# Altium schematic sheet POWER_3.SchDoc
size A; SheetNumber: 5; SheetTotal: 14
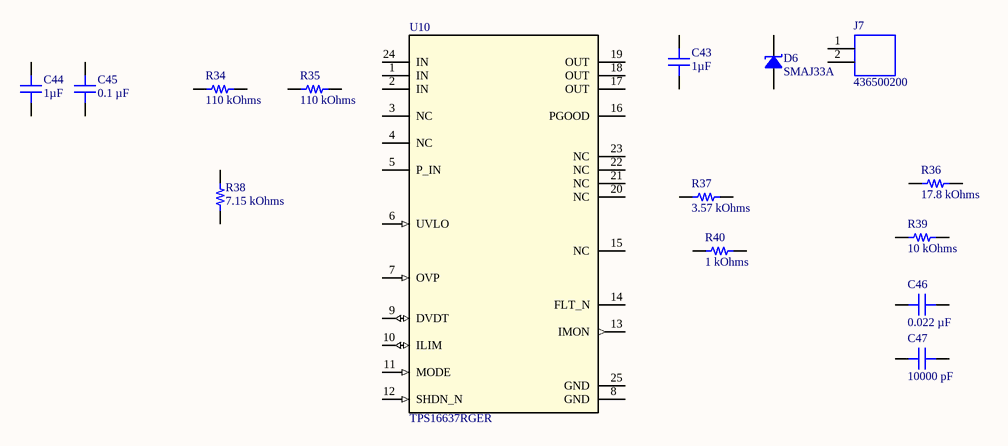
[diagram p0: POWER_3.SchDoc]

## Parts
C43  1µF  [CAP 0805_2012]
C44  1µF  [CAP 0805_2012]
C45  0.1 µF  [CAP 0603_1608]
C46  0.022 µF  [CAP 0603_1608]
C47  10000 pF  [CAP 0603_1608]
D6  SMAJ33A  [DO214AC SMA]
J7  436500200  [CONN_SD-43650-001_02_MOL]
R34  110 kOhms  [RES 0603_1608]
R35  110 kOhms  [RES 0603_1608]
R36  17.8 kOhms  [RES 0603_1608]
R37  3.57 kOhms  [RES 0603_1608]
R38  7.15 kOhms  [RES 0603_1608]
R39  10 kOhms  [RES 0603_1608]
R40  1 kOhms  [RES 0603_1608]
U10  TPS16637RGER  [RGE0024H]

## Nets

Not connected (* = marked no-connect by the designer): C43 1 2; C44 1 2; C45 1 2; C46 1 2; C47 1 2; D6 1 2; J7 1 2; R34 1 2; R35 1 2; R36 1 2; R37 1 2; R38 1 2; R39 1 2; R40 1 2; U10 1(IN) 2(IN) 3(NC) 4(NC) 5(P_IN) 6(UVLO) 7(OVP) 8(GND) 9(DVDT) 10(ILIM) 11(MODE) 12(SHDN_N) 13(IMON) 14(FLT_N) 15(NC) 16(PGOOD) 17(OUT) 18(OUT) 19(OUT) 20(NC) 21(NC) 22(NC) 23(NC) 24(IN) 25(GND)

## Library data of the parts
C43 C44 = 08051C105K4T2A: CAP CER 1UF 100V X7R 0805; manufacturer: AVX Corporation; Tolerance: ±10%; Part Number: 08051C105K4T2A; Capacitance: 1µF; Applications: Automotive; componentlink1description: Datasheet; componentlink1url: http://datasheets.avx.com/AutoMLCC.pdf; componentlink2description: DigiKey Link; componentlink2url: http://digikey.com/product-detail/en/avx-corporation/08051C105K4T2A/478-12142-1-ND/9374711; Device Package: 0805 (2012 Metric); lastupdated: 2.09.2020 01:04:22; Lifecycle Status: Active; Minimum Order: 1; Mounting Type: Surface Mount, MLCC; Operating Temperature: -55°C ~ 125°C; Package / Case: 0805 (2012 Metric); packaging: TapeAndReel; partid: 13414; Part Status: Active; price: 0.09; Ratings: AEC-Q200; series: -; Size / Dimension: 0.079" L x 0.049" W (2.01mm x 1.25mm); Supplier 1: DigiKey; Supplier Part Number 1: 478-12142-1-ND; Temperature Coefficient: X7R; value: 1µF; Voltage - Rated: 100V
C45 = HMK107BJ104KA-T: CAP CER 0.1UF 100V X5R 0603; manufacturer: Taiyo Yuden; Tolerance: ±10%; Part Number: HMK107BJ104KA-T; Capacitance: 0.1 µF; Applications: SMPS Filtering; componentlink1description: Datasheet; componentlink1url: https://ds.yuden.co.jp/TYCOMPAS/ut/detail?pn=HMK107BJ104KA-T  &u=M; componentlink2description: DigiKey Link; componentlink2url: https://www.digikey.com/en/products/detail/taiyo-yuden/HMK107BJ104KA-T/4970694; Device Package: 0603 (1608 Metric); Features: High Voltage; lastupdated: 6.04.2026 19:23:31; Lifecycle Status: Active; Minimum Order: 1; Mounting Type: Surface Mount, MLCC; Operating Temperature: -55°C ~ 85°C; Package / Case: 0603 (1608 Metric); packaging: TapeAndReel; partid: 8162; Part Status: Active; price: 0.01; series: M; Size / Dimension: 0.063" L x 0.031" W (1.60mm x 0.80mm); Supplier 1: DigiKey; Supplier Part Number 1: 587-5862-1-ND; Temperature Coefficient: X5R; Thickness (Max): 0.035" (0.90mm); value: 0.1 µF; Voltage - Rated: 100V
C46 = CL10B223KO8WPNC: CAP CER 22NF 16V X7R 0603; manufacturer: Samsung Electro-Mechanics; Tolerance: ±10%; Part Number: CL10B223KO8WPNC; Capacitance: 0.022 µF; Applications: Automotive; componentlink1description: Datasheet; componentlink1url: https://mm.digikey.com/Volume0/opasdata/d220001/medias/docus/5458/CL10B223KO8WPNC_Spec.pdf; componentlink2description: DigiKey Link; componentlink2url: https://www.digikey.com/en/products/detail/samsung-electro-mechanics/CL10B223KO8WPNC/20498563; Device Package: 0603 (1608 Metric); Features: Open Mode; lastupdated: 6.04.2026 19:17:38; Lifecycle Status: Active; Minimum Order: 1; Mounting Type: Surface Mount, MLCC, Epoxy; Operating Temperature: -55°C ~ 125°C; Package / Case: 0603 (1608 Metric); packaging: TapeAndReel; partid: 64880; price: 0.01; Ratings: AEC-Q200; series: CL; Size / Dimension: 0.063" L x 0.031" W (1.60mm x 0.80mm); Supplier 1: DigiKey; Supplier Part Number 1: 1276-CL10B223KO8WPNCCT-ND; Temperature Coefficient: X7R; Thickness (Max): 0.035" (0.88mm); value: 0.022 µF; Voltage - Rated: 16V
C47 = C0603C103M4REC7411: CAP CER 0603 10NF 16V X7R 20%; manufacturer: KEMET; Part Number: C0603C103M4REC7411; Capacitance: 10000 pF; Applications: ESD Protection; componentlink1description: Datasheet; componentlink1url: https://connect.kemet.com:7667/gateway/IntelliData-ComponentDocumentation/1.0/download/datasheet/C0603C103M4REC7411; componentlink2description: DigiKey Link; componentlink2url: https://www.digikey.com/en/products/detail/kemet/C0603C103M4REC7411/8645113; Device Package: 0603 (1608 Metric); lastupdated: 6.04.2026 19:20:47; Lifecycle Status: Active; Minimum Order: 1; Mounting Type: Surface Mount, MLCC; Operating Temperature: -55°C ~ 125°C; Package / Case: 0603 (1608 Metric); packaging: TapeAndReel; partid: 52195; Part Status: Active; price: 0.01; series: ESD SMD Comm X7R; Size / Dimension: 0.063" L x 0.031" W (1.60mm x 0.80mm); Supplier 1: DigiKey; Supplier Part Number 1: 399-C0603C103M4REC7411CT-ND; Temperature Coefficient: X7R; Thickness (Max): 0.034" (0.87mm); Tolerance: ±20%; value: 10000 pF; Voltage - Rated: 16V
D6 = SMAJ33A: TVS DIODE 33VWM 53.3VC DO214AC; Manufacturer: Littelfuse Inc.; Current - Peak Pulse (10/1000µs): 7.5A; Power Line Protection: No; Power - Peak Pulse: 400W; Type: Zener; Unidirectional Channels: 1; Voltage - Breakdown (Min): 36.7V; Voltage - Clamping (Max) @ Ipp: 53.3V; Voltage - Reverse Standoff (Typ): 33V; Part Number: SMAJ33A; Applications: General Purpose; ComponentLink1Description: Datasheet; ComponentLink1URL: https://www.littelfuse.com/~/media/electronics/datasheets/tvs_diodes/littelfuse_tvs_diode_smaj_datasheet.pdf.pdf; ComponentLink2Description: DigiKey Link; ComponentLink2URL: https://www.digikey.com/en/products/detail/littelfuse-inc/SMAJ33A/762296; LastUpdated: 5.04.2026 20:34:16; Lifecycle Status: Active; Minimum Order: 1; Mounting Type: Surface Mount; Operating Temperature: -65°C ~ 150°C (TJ); Package / Case: DO-214AC, SMA; Packaging: TapeAndReel; PartId: 5718; Part Status: Active; Price: 0.06; Series: SMAJ; Supplier 1: DigiKey; Supplier Part Number 1: SMAJ33ALFCT-ND; Supplier Device Package: DO-214AC (SMA)
J7 = 436500200: Connector Header Through Hole, Right Angle 2 position 0.118 (3.00mm); MF: Molex; SnapEDA_Link: https://www.snapeda.com/parts/436500200/Molex/view-part/?ref=snap; Package: None; Value: *; MP: 436500200; Check_prices: https://www.snapeda.com/parts/436500200/Molex/view-part/?ref=eda
R34 R35 = RMCF0603FT110K: RES 110K OHM 1% 1/10W 0603; Manufacturer: Stackpole Electronics Inc; Power (Watts): 0.1W, 1/10W; Temperature Coefficient: ±100ppm/°C; Part Number: RMCF0603FT110K; Value: 110 kOhms; ComponentLink1Description: Datasheet; ComponentLink1URL: https://www.seielect.com/catalog/sei-packaging.pdf; ComponentLink2Description: DigiKey Link; ComponentLink2URL: https://www.digikey.com/en/products/detail/stackpole-electronics-inc/RMCF0603FT110K/1761310; Composition: Thick Film; Device Package: 0603 (1608 Metric); Features: Automotive AEC-Q200; Height - Seated (Max): 0.022" (0.55mm); LastUpdated: 9.02.2024 20:43:13; Lifecycle Status: Active; Minimum Order: 1; Number of Terminations: 2; Operating Temperature: -55°C ~ 155°C; Package / Case: 0603 (1608 Metric); Packaging: CutTape; PartId: 10728; Part Status: Active; Price: 0.01; Ratings: AEC-Q200; Resistance: 110 kOhms; Series: RMCF; Size / Dimension: 0.061" L x 0.031" W (1.55mm x 0.80mm); Supplier 1: DigiKey; Supplier Part Number 1: RMCF0603FT110KCT-ND; Supplier Device Package: 0603; Tolerance: ±1%
R36 = RMCF0603FG17K8: RES 17.8K OHM 1% 1/10W 0603; Manufacturer: Stackpole Electronics Inc; Power (Watts): 0.1W, 1/10W; Temperature Coefficient: ±100ppm/°C; Part Number: RMCF0603FG17K8; Value: 17.8 kOhms; ComponentLink1Description: Datasheet; ComponentLink1URL: https://www.seielect.com/catalog/sei-rmcf_rmcp.pdf; ComponentLink2Description: DigiKey Link; ComponentLink2URL: https://www.digikey.com/en/products/detail/stackpole-electronics-inc/RMCF0603FG17K8/1713668; Composition: Thick Film; Device Package: 0603 (1608 Metric); Features: Automotive AEC-Q200; Height - Seated (Max): 0.022" (0.55mm); LastUpdated: 9.02.2024 20:42:38; Lifecycle Status: Active; Minimum Order: 1; Number of Terminations: 2; Operating Temperature: -55°C ~ 155°C; Package / Case: 0603 (1608 Metric); Packaging: CutTape; PartId: 19862; Part Status: Active; Price: 0.01; Ratings: AEC-Q200; Resistance: 17.8 kOhms; Series: RMCF; Size / Dimension: 0.061" L x 0.031" W (1.55mm x 0.80mm); Supplier 1: DigiKey; Supplier Part Number 1: RMCF0603FG17K8CT-ND; Supplier Device Package: 0603; Tolerance: ±1%
R37 = RMCF0603FT3K57: RES 3.57K OHM 1% 1/10W 0603; Manufacturer: Stackpole Electronics Inc; Power (Watts): 0.1W, 1/10W; Temperature Coefficient: ±100ppm/°C; Part Number: RMCF0603FT3K57; Value: 3.57 kOhms; ComponentLink1Description: Datasheet; ComponentLink1URL: https://www.seielect.com/catalog/sei-rmcf_rmcp.pdf; ComponentLink2Description: DigiKey Link; ComponentLink2URL: https://www.digikey.com/en/products/detail/stackpole-electronics-inc/RMCF0603FT3K57/1761029; Composition: Thick Film; Device Package: 0603 (1608 Metric); Features: Automotive AEC-Q200; Height - Seated (Max): 0.022" (0.55mm); LastUpdated: 9.02.2024 20:42:52; Lifecycle Status: Active; Minimum Order: 1; Number of Terminations: 2; Operating Temperature: -55°C ~ 155°C; Package / Case: 0603 (1608 Metric); Packaging: CutTape; PartId: 16325; Part Status: Active; Price: 0.01; Ratings: AEC-Q200; Resistance: 3.57 kOhms; Series: RMCF; Size / Dimension: 0.061" L x 0.031" W (1.55mm x 0.80mm); Supplier 1: DigiKey; Supplier Part Number 1: RMCF0603FT3K57CT-ND; Supplier Device Package: 0603; Tolerance: ±1%
R38 = RMCF0603FT7K15: RES 7.15K OHM 1% 1/10W 0603; Manufacturer: Stackpole Electronics Inc; Power (Watts): 0.1W, 1/10W; Temperature Coefficient: ±100ppm/°C; Part Number: RMCF0603FT7K15; Value: 7.15 kOhms; ComponentLink1Description: Datasheet; ComponentLink1URL: https://www.seielect.com/catalog/sei-packaging.pdf; ComponentLink2Description: DigiKey Link; ComponentLink2URL: https://www.digikey.com/en/products/detail/stackpole-electronics-inc/RMCF0603FT7K15/1760937; Composition: Thick Film; Device Package: 0603 (1608 Metric); Features: Automotive AEC-Q200; Height - Seated (Max): 0.022" (0.55mm); LastUpdated: 9.02.2024 20:42:27; Lifecycle Status: Active; Minimum Order: 1; Number of Terminations: 2; Operating Temperature: -55°C ~ 155°C; Package / Case: 0603 (1608 Metric); Packaging: CutTape; PartId: 22551; Part Status: Active; Price: 0.01; Ratings: AEC-Q200; Resistance: 7.15 kOhms; Series: RMCF; Size / Dimension: 0.061" L x 0.031" W (1.55mm x 0.80mm); Supplier 1: DigiKey; Supplier Part Number 1: RMCF0603FT7K15CT-ND; Supplier Device Package: 0603; Tolerance: ±1%
R39 = RMCF0603FT10K0: RES 10K OHM 1% 1/10W 0603; Manufacturer: Stackpole Electronics Inc; Power (Watts): 0.1W, 1/10W; Temperature Coefficient: ±100ppm/°C; Part Number: RMCF0603FT10K0; Value: 10 kOhms; ComponentLink1Description: Datasheet; ComponentLink1URL: https://www.seielect.com/catalog/sei-rmcf_rmcp.pdf; ComponentLink2Description: DigiKey Link; ComponentLink2URL: https://www.digikey.com/en/products/detail/stackpole-electronics-inc/RMCF0603FT10K0/1761235; Composition: Thick Film; Device Package: 0603 (1608 Metric); Features: Automotive AEC-Q200; Height - Seated (Max): 0.022" (0.55mm); LastUpdated: 9.02.2024 20:42:00; Lifecycle Status: Active; Minimum Order: 1; Number of Terminations: 2; Operating Temperature: -55°C ~ 155°C; Package / Case: 0603 (1608 Metric); Packaging: CutTape; PartId: 25663; Part Status: Active; Price: 0.01; Ratings: AEC-Q200; Resistance: 10 kOhms; Series: RMCF; Size / Dimension: 0.061" L x 0.031" W (1.55mm x 0.80mm); Supplier 1: DigiKey; Supplier Part Number 1: RMCF0603FT10K0CT-ND; Supplier Device Package: 0603; Tolerance: ±1%
R40 = RMCF0603FG1K00: RES 1K OHM 1% 1/10W 0603; Manufacturer: Stackpole Electronics Inc; Power (Watts): 0.1W, 1/10W; Temperature Coefficient: ±100ppm/°C; Part Number: RMCF0603FG1K00; Value: 1 kOhms; ComponentLink1Description: Datasheet; ComponentLink1URL: https://www.seielect.com/catalog/sei-packaging.pdf; ComponentLink2Description: DigiKey Link; ComponentLink2URL: https://www.digikey.com/en/products/detail/stackpole-electronics-inc/RMCF0603FG1K00/1713699; Composition: Thick Film; Device Package: 0603 (1608 Metric); Features: Automotive AEC-Q200; Height - Seated (Max): 0.022" (0.55mm); LastUpdated: 9.02.2024 20:42:15; Lifecycle Status: Active; Minimum Order: 1; Number of Terminations: 2; Operating Temperature: -55°C ~ 155°C; Package / Case: 0603 (1608 Metric); Packaging: CutTape; PartId: 24034; Part Status: Active; Price: 0.01; Ratings: AEC-Q200; Resistance: 1 kOhms; Series: RMCF; Size / Dimension: 0.061" L x 0.031" W (1.55mm x 0.80mm); Supplier 1: DigiKey; Supplier Part Number 1: RMCF0603FG1K00CT-ND; Supplier Device Package: 0603; Tolerance: ±1%
U10 = TPS16637RGER: 4.5-V to 60-V, 31mÎ©, 0.6-6A eFuse with output power limiting 24-VQFN -40 to 125; Manufacturer_Name: Texas Instruments; TYPE: TYPE; RefDes: RefDes; Copyright: Copyright (C) 2025 Ultra Librarian. All rights reserved.; Manufacturer_Part_Number: TPS16637RGER